# Altium schematic sheet FPGA Power.SchDoc
size E
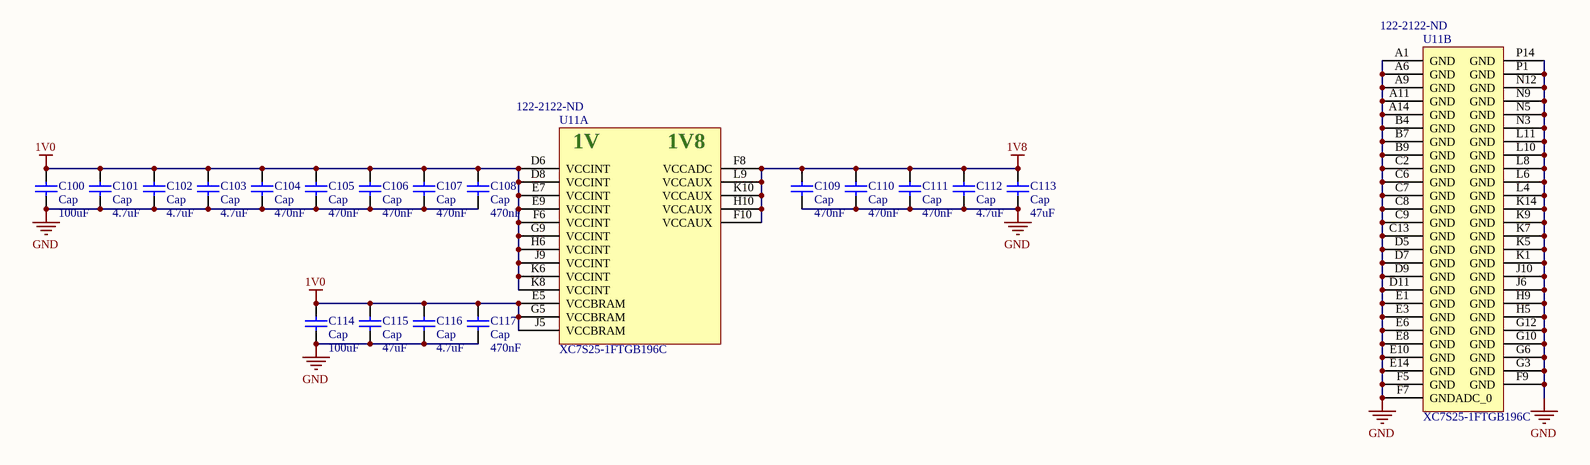
[diagram p0: FPGA Power.SchDoc]

## Parts
C100  Cap  value 100uF  [C1210]
C101  Cap  value 4.7uF  [6-0805_M]
C102  Cap  value 4.7uF  [6-0805_M]
C103  Cap  value 4.7uF  [6-0805_M]
C104  Cap  value 470nF  [1608[0603]]
C105  Cap  value 470nF  [1608[0603]]
C106  Cap  value 470nF  [1608[0603]]
C107  Cap  value 470nF  [1608[0603]]
C108  Cap  value 470nF  [1608[0603]]
C109  Cap  value 470nF  [1608[0603]]
C110  Cap  value 470nF  [1608[0603]]
C111  Cap  value 470nF  [1608[0603]]
C112  Cap  value 4.7uF  [6-0805_M]
C113  Cap  value 47uF  [C1210]
C114  Cap  value 100uF  [C1210]
C115  Cap  value 47uF  [C1210]
C116  Cap  value 4.7uF  [6-0805_M]
C117  Cap  value 470nF  [1608[0603]]
U11  XC7S25-1FTGB196C  Supplier Part Number 1: 122-2122-ND  [FTGB196 Package]  (parts A,B of 5)

## Nets
1V0: C100.2 C101.2 C102.2 C103.2 C104.2 C105.2 C106.2 C107.2 C108.2 C114.2 C115.2 C116.2 C117.2 U11.D6(VCCINT) U11.D8(VCCINT) U11.E5(VCCBRAM) U11.E7(VCCINT) U11.E9(VCCINT) U11.F6(VCCINT) U11.G5(VCCBRAM) U11.G9(VCCINT) U11.H6(VCCINT) U11.J5(VCCBRAM) U11.J9(VCCINT) U11.K6(VCCINT) U11.K8(VCCINT)
1V8: C109.2 C110.2 C111.2 C112.2 C113.2 U11.F8(VCCADC) U11.F10(VCCAUX) U11.H10(VCCAUX) U11.K10(VCCAUX) U11.L9(VCCAUX)
GND: C100.1 C101.1 C102.1 C103.1 C104.1 C105.1 C106.1 C107.1 C108.1 C109.1 C110.1 C111.1 C112.1 C113.1 C114.1 C115.1 C116.1 C117.1 U11.A1(GND) U11.A6(GND) U11.A9(GND) U11.A11(GND) U11.A14(GND) U11.B4(GND) U11.B7(GND) U11.B9(GND) U11.C2(GND) U11.C6(GND) U11.C7(GND) U11.C8(GND) U11.C9(GND) U11.C13(GND) U11.D5(GND) U11.D7(GND) U11.D9(GND) U11.D11(GND) U11.E1(GND) U11.E3(GND) U11.E6(GND) U11.E8(GND) U11.E10(GND) U11.E14(GND) U11.F5(GND) U11.F7(GNDADC_0) U11.F9(GND) U11.G3(GND) U11.G6(GND) U11.G10(GND) U11.G12(GND) U11.H5(GND) U11.H9(GND) U11.J6(GND) U11.J10(GND) U11.K1(GND) U11.K5(GND) U11.K7(GND) U11.K9(GND) U11.K14(GND) U11.L4(GND) U11.L6(GND) U11.L8(GND) U11.L10(GND) U11.L11(GND) U11.N3(GND) U11.N5(GND) U11.N9(GND) U11.N12(GND) U11.P1(GND) U11.P14(GND)

## Notes on the sheet
- (in symbol XC7S25-1FTGB196C, part A) 1V; 1V8

## Library data of the parts
C100-C117 = Cap: Capacitor; Published: 8-Jun-2000; LatestRevisionDate: 17-Jul-2002; LatestRevisionNote: Re-released for DXP Platform.; PackageReference: RAD-0.3; Publisher: Altium Limited; PackageDescription: Radial Cap, Thru-Hole; 2 Leads; 0.3 in Pin Spacing
  C100 C114: ComponentLink1Description: New link; ComponentLink1URL: *; Supplier 1: Digi-Key; Supplier Part Number 1: 490-9969-1-ND
  C101-C103 C112 C116: Supplier 1: Digi-Key; Supplier Part Number 1: 490-14466-1-ND
  C113 C115: Supplier 1: Digi-Key; Supplier Part Number 1: 490-4844-1-ND
U11 = XC7S25-1FTGB196C: Supplier 1: Digi-Key